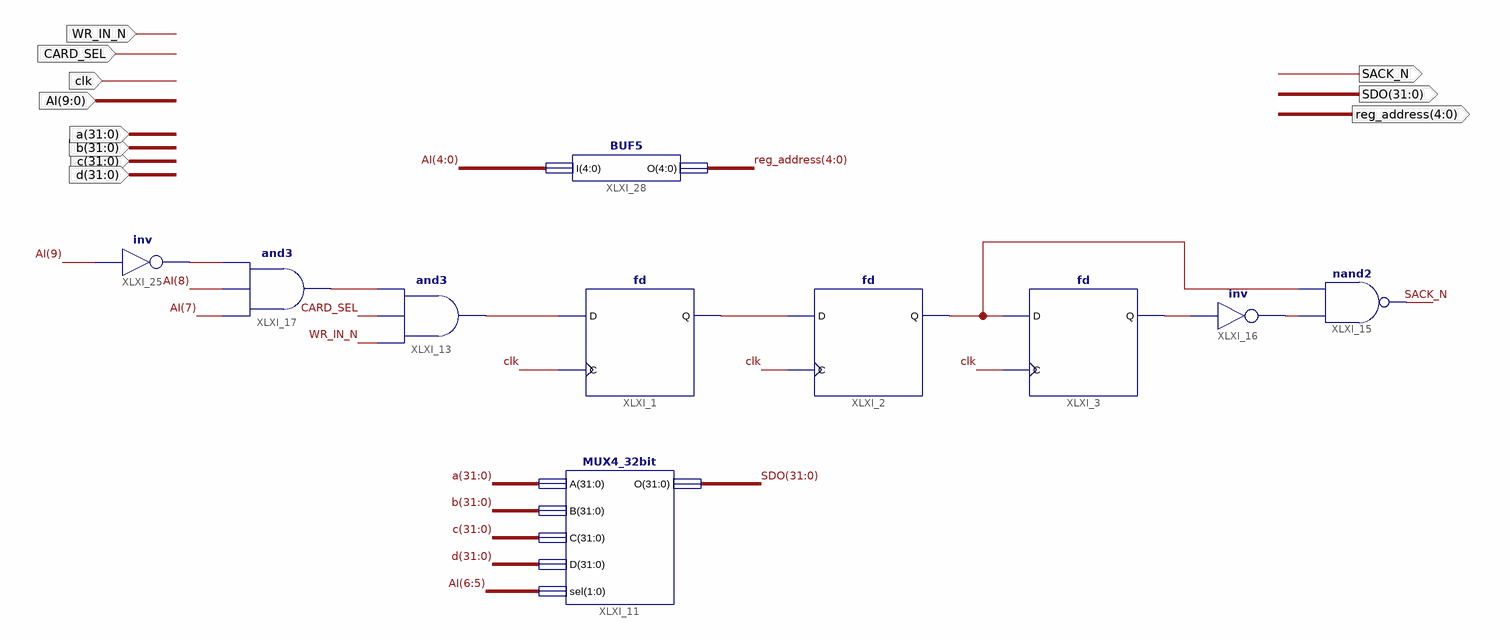
[diagram p0: schematic sheet 1]
// Xilinx ISE schematic slvaeAO.sch (artix7) as structural Verilog: 10 symbols, 11 ports
module slvaeAO (
  input  clk,
  input  [9:0] AI,
  input  [31:0] a,
  input  [31:0] b,
  input  [31:0] c,
  input  [31:0] d,
  input  CARD_SEL,
  input  WR_IN_N,
  output SACK_N,
  output [31:0] SDO,
  output [4:0] reg_address
);

  wire XLXN_18, XLXN_19, XLXN_20, XLXN_22, XLXN_23, XLXN_30, XLXN_33;

  fd XLXI_3 (.C(clk), .D(XLXN_20), .Q(XLXN_19));
  fd XLXI_1 (.C(clk), .D(XLXN_23), .Q(XLXN_22));
  and XLXI_13 (XLXN_23, WR_IN_N, CARD_SEL, XLXN_30);
  nand XLXI_15 (SACK_N, XLXN_18, XLXN_20);
  not XLXI_16 (XLXN_18, XLXN_19);
  fd XLXI_2 (.C(clk), .D(XLXN_22), .Q(XLXN_20));
  and XLXI_17 (XLXN_30, AI[7], AI[8], XLXN_33);
  not XLXI_25 (XLXN_33, AI[9]);
  BUF5 XLXI_28 (.I(AI[4:0]), .O(reg_address));
  MUX4_32bit XLXI_11 (.A(a), .B(b), .C(c), .D(d), .sel(AI[6:5]), .O(SDO));
endmodule
